# Altium schematic sheet Top.SchDoc: MICROSWIFT 2L - TOP
size 431 x 279 mm; Address1: APPLIED PHYSICS LAB; Address2: UNIVERSITY OF WASHINGTON; Address3: 1013 NE 40TH STREET; Address4: SEATTLE, WA 98105; DocumentNumber: 1; SheetNumber: 1; SheetTotal: 18; ENG_APP_DATE: --/--/--; DSN_APP_DATE: --/--/--; CHK_APP_DATE: --/--/--
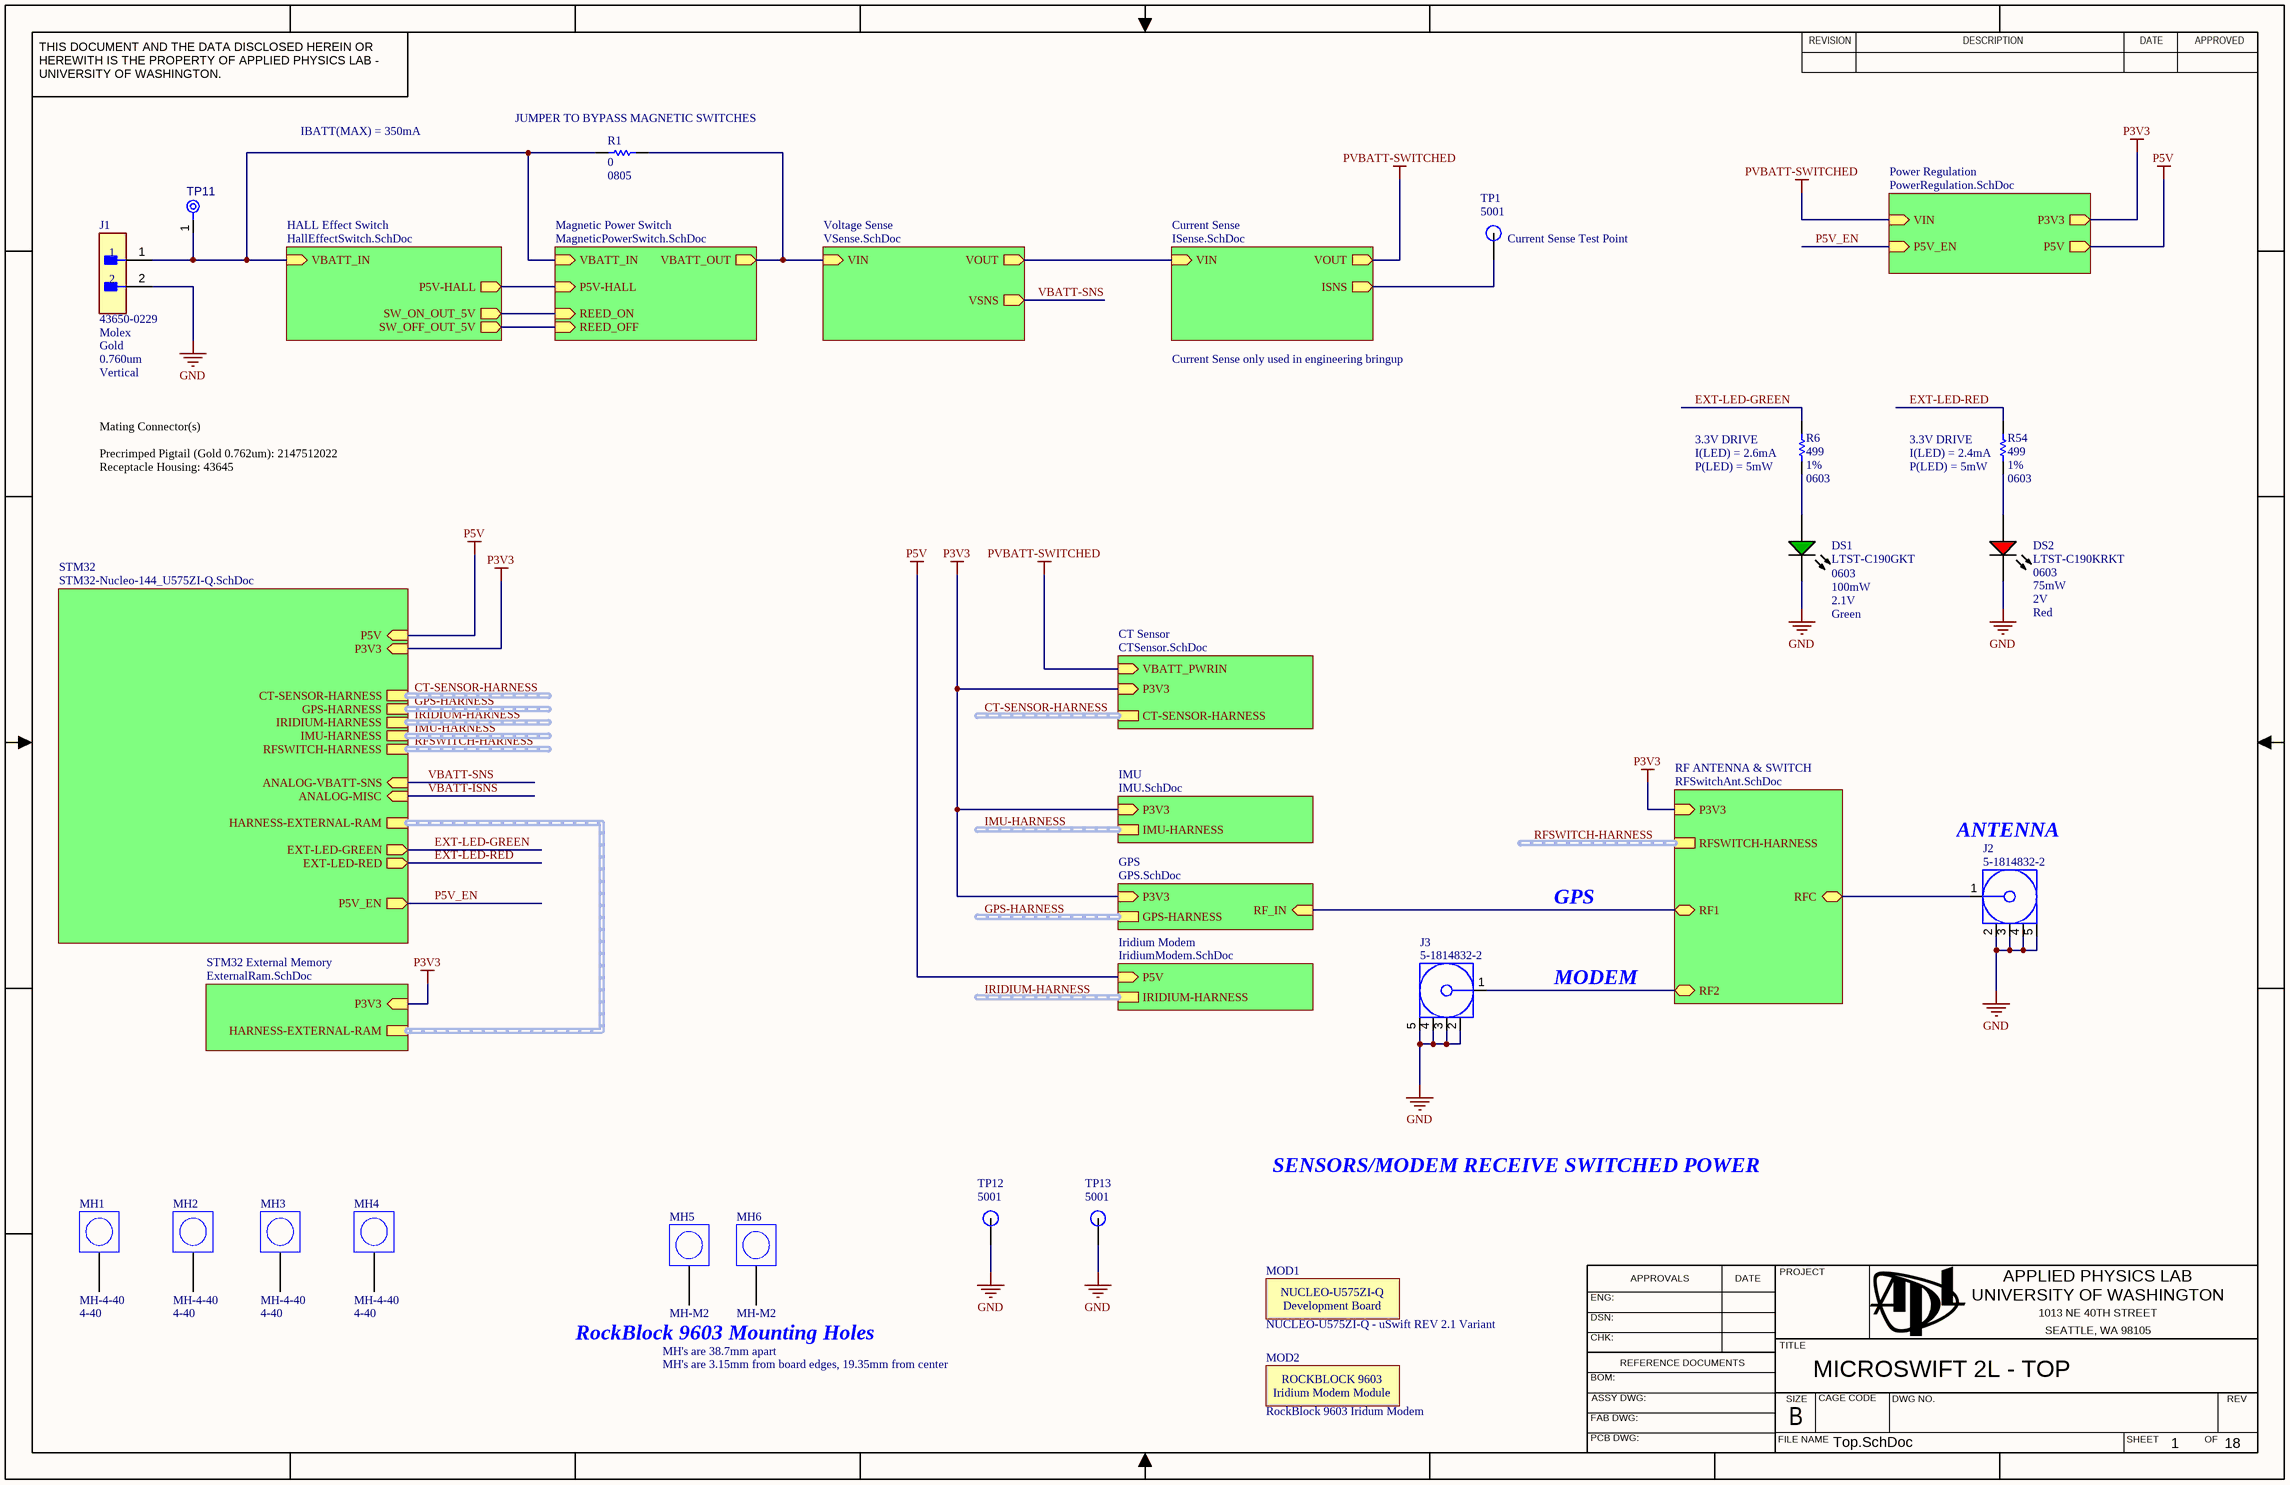
[diagram p0: Top.SchDoc]

## Parts
DS1  LTST-C190GKT  Power: 100mW  Colour: Green  Forward Voltage: 2.1V  Case/Package: 0603  [LTST-C190GKT_V]
DS2  LTST-C190KRKT  Case/Package: 0603  Power: 75mW  Forward Voltage: 2V  Illumination Colour: Red  [LTST-C191KRKT_V]
J1  43650-0229  Manufacturer: Molex  Contact Plating: Gold  Plating Thickness: 0.760um  Orientation: Vertical  [FP-43650-0229-MFG]
J2  5-1814832-2  [FP-5-1814832-2-MFG]
J3  5-1814832-2  [FP-5-1814832-2-MFG]
MH1  MH-4-40  Fastener Size: 4-40  [MH-4-40-Footprint]  (no BOM)
MH2  MH-4-40  Fastener Size: 4-40  [MH-4-40-Footprint]  (no BOM)
MH3  MH-4-40  Fastener Size: 4-40  [MH-4-40-Footprint]  (no BOM)
MH4  MH-4-40  Fastener Size: 4-40  [MH-4-40-Footprint]  (no BOM)
MH5  MH-M2  [MH-M2-Footprint]  (no BOM)
MH6  MH-M2  [MH-M2-Footprint]  (no BOM)
MOD1  NUCLEO-U575ZI-Q - uSwift REV 2.1 Variant  [NUCLEO-U575ZI-Q - uSwift REV 2.1 Variant]
MOD2  RockBlock 9603 Iridum Modem  [RockBlock 9603]
R1  value 0  Case/Package: 0805  [RESC2013X60X35ML10T20]  (hidden comment: Resistor 0R +/- 5% 0805 125 mW)
R6  value 499  Tolerance: 1%  Case/Package: 0603  [RESC1609X50X30ML08T20]  (hidden comment: Resistor 499R +/-1% 0603 100 mW)
R54  value 499  Tolerance: 1%  Case/Package: 0603  [RESC1609X50X30ML08T20]  (hidden comment: Resistor 499R +/-1% 0603 100 mW)
TP1  5001  [FP-5001-MFG]
TP11  TPAD6R-CIRCLED  [TP06R - Circled]  (value not drawn)  (no BOM)
TP12  5001  [FP-5001-MFG]
TP13  5001  [FP-5001-MFG]

## Sub-sheets
CT Sensor = CTSensor.SchDoc: VBATT_PWRIN (in), P3V3 (in), CT-SENSOR-HARNESS (harness CT-SENSOR)
Current Sense = ISense.SchDoc: VIN (in), VOUT (out), ISNS (out)
GPS = GPS.SchDoc: RF_IN (in), P3V3 (in), GPS-HARNESS (harness GPS)
HALL Effect Switch = HallEffectSwitch.SchDoc: VBATT_IN (in), SW_ON_OUT_5V (out), SW_OFF_OUT_5V (out), P5V-HALL (out)
IMU = IMU.SchDoc: P3V3 (in), IMU-HARNESS (harness IMU)
Iridium Modem = IridiumModem.SchDoc: P5V (in), IRIDIUM-HARNESS (harness IRIDIUM)
Magnetic Power Switch = MagneticPowerSwitch.SchDoc: VBATT_OUT (out), REED_ON (in), REED_OFF (in), VBATT_IN (in), P5V-HALL (in)
Power Regulation = PowerRegulation.SchDoc: VIN (in), P3V3 (out), P5V (out), P5V_EN (in)
RF ANTENNA & SWITCH = RFSwitchAnt.SchDoc: RF1 (bidir), RF2 (bidir), RFC (bidir), P3V3 (in), RFSWITCH-HARNESS (harness RFSWITCH)
STM32 = STM32-Nucleo-144_U575ZI-Q.SchDoc: P5V (in), P3V3 (in), CT-SENSOR-HARNESS (harness CT-SENSOR), GPS-HARNESS (harness GPS), IRIDIUM-HARNESS (harness IRIDIUM), IMU-HARNESS (harness IMU), RFSWITCH-HARNESS (harness RFSWITCH), ANALOG-VBATT-SNS (in), ANALOG-MISC (in), HARNESS-EXTERNAL-RAM (harness EXTERNAL-RAM), EXT-LED-GREEN (out), EXT-LED-RED (out), P5V_EN (out)
STM32 External Memory = ExternalRam.SchDoc: HARNESS-EXTERNAL-RAM (harness EXTERNAL-RAM), P3V3 (in)
Voltage Sense = VSense.SchDoc: VIN (in), VOUT (out), VSNS (out)

## Nets
GND: DS1.2(K) DS2.2(K) J1.2 J2.2 J2.3 J2.4 J2.5 J3.2 J3.3 J3.4 J3.5 TP12.1 TP13.1
P3V3: sheet STM32/P3V3, sheet Power Regulation/P3V3, sheet CT Sensor/P3V3, sheet IMU/P3V3, sheet RF ANTENNA & SWITCH/P3V3, sheet GPS/P3V3, sheet STM32 External Memory/P3V3
P5V: sheet STM32/P5V, sheet Power Regulation/P5V, sheet Iridium Modem/P5V
PVBATT-SWITCHED: sheet Power Regulation/VIN, sheet Current Sense/VOUT, sheet CT Sensor/VBATT_PWRIN
EXT-LED-GREEN: R6.1 ; sheet STM32/EXT-LED-GREEN
EXT-LED-RED: R54.1 ; sheet STM32/EXT-LED-RED
P5V_EN: sheet STM32/P5V_EN, sheet Power Regulation/P5V_EN
VBATT-ISNS: sheet STM32/ANALOG-MISC
VBATT-SNS: sheet STM32/ANALOG-VBATT-SNS, sheet Voltage Sense/VSNS
NetDS1_1: DS1.1(A) R6.2
NetDS2_1: DS2.1(A) R54.2
NetJ1_1: J1.1 R1.1 TP11.1(TP) ; sheet HALL Effect Switch/VBATT_IN, sheet Magnetic Power Switch/VBATT_IN
NetJ2_1: J2.1 ; sheet RF ANTENNA & SWITCH/RFC
NetJ3_1: J3.1 ; sheet RF ANTENNA & SWITCH/RF2
NetR1_2: R1.2 ; sheet Voltage Sense/VIN, sheet Magnetic Power Switch/VBATT_OUT
NetTP1_1: TP1.1 ; sheet Current Sense/ISNS
(unnamed): sheet Voltage Sense/VOUT, sheet Current Sense/VIN
(unnamed): sheet RF ANTENNA & SWITCH/RF1, sheet GPS/RF_IN
(unnamed): sheet HALL Effect Switch/SW_ON_OUT_5V, sheet Magnetic Power Switch/REED_ON
(unnamed): sheet HALL Effect Switch/SW_OFF_OUT_5V, sheet Magnetic Power Switch/REED_OFF
(unnamed): sheet HALL Effect Switch/P5V-HALL, sheet Magnetic Power Switch/P5V-HALL

Not connected (* = marked no-connect by the designer): MH1 1; MH2 1; MH3 1; MH4 1; MH5 1; MH6 1

## Buses and harness runs
harness CT-SENSOR-HARNESS = sheet CT Sensor/CT-SENSOR-HARNESS
harness CT-SENSOR-HARNESS = sheet STM32/CT-SENSOR-HARNESS
harness GPS-HARNESS = sheet GPS/GPS-HARNESS
harness GPS-HARNESS = sheet STM32/GPS-HARNESS
harness IMU-HARNESS = sheet IMU/IMU-HARNESS
harness IMU-HARNESS = sheet STM32/IMU-HARNESS
harness IRIDIUM-HARNESS = sheet Iridium Modem/IRIDIUM-HARNESS
harness IRIDIUM-HARNESS = sheet STM32/IRIDIUM-HARNESS
harness RFSWITCH-HARNESS = sheet RF ANTENNA & SWITCH/RFSWITCH-HARNESS
harness RFSWITCH-HARNESS = sheet STM32/RFSWITCH-HARNESS
harness sheet STM32 External Memory/HARNESS-EXTERNAL-RAM = sheet STM32/HARNESS-EXTERNAL-RAM

## Notes on the sheet
- IBATT(MAX) = 350mA
- (near R1) JUMPER TO BYPASS MAGNETIC SWITCHES
- (near TP1) Current Sense Test Point
- Current Sense only used in engineering bringup
- Mating Connector(s)
  Precrimped Pigtail (Gold 0.762um): 2147512022
  Receptacle Housing: 43645
- (near R6) 3.3V DRIVE
- (near R6) I(LED) = 2.6mA
- (near R6) P(LED) = 5mW
- (near R54) 3.3V DRIVE
- (near R54) I(LED) = 2.4mA
- (near R54) P(LED) = 5mW
- ANTENNA
- GPS
- MODEM
- SENSORS/MODEM RECEIVE SWITCHED POWER
- RockBlock 9603 Mounting Holes
- MH's are 38.7mm apart
- MH's are 3.15mm from board edges, 19.35mm from center
- THIS DOCUMENT AND THE DATA DISCLOSED HEREIN OR HEREWITH IS THE PROPERTY OF APPLIED PHYSICS LAB - UNIVERSITY OF WASHINGTON.
- REVISION
- DESCRIPTION
- DATE
- APPROVED
- ENG:
- APPROVALS
- PROJECT
- DSN:
- CHK:
- REFERENCE DOCUMENTS
- TITLE
- BOM:
- FAB DWG:
- PCB DWG:
- ASSY DWG:
- FILE NAME
- SIZE
- B
- CAGE CODE
- DWG NO.
- SHEET
- OF
- REV
- (in symbol CMP-001-0007-2) NUCLEO-U575ZI-Q; Development Board
- (in symbol CMP-001-0008-2) ROCKBLOCK 9603; Iridium Modem Module

## Library data of the parts
DS1 = CMP-007-00022-3: LED Uni-Color Green, 100 mW, 30 mA, -55 to 85 degC, 2-Pin SMD, RoHS, Tape and Reel; Manufacturer: Lite-On; Viewing Angle: 130degrees; Forward Current: 20mA; Luminous Intensity: 6mcd; Lens Style: Clear; Manufacturer URL: http://www.us.liteon.com/; RoHS Compliant: True; Package Description: 2-Pin Surface Mount Device, Body 1.6 x 0.8 mm; Datasheet URL: http://datasheet.octopart.com/LTST-C190GKT-Lite-On-datasheet-158530.pdf; Datasheet Version: Dec-06; Package Reference: C190GKT; Packaging: TapeandReel; Min Operating Temperature: -55°C; Nominal Vf: 2.1V; Package Quantity: 3000; Illumination Colour: Green; Max Operating Temperature: 85°C; Pins: 2; Mount: Surface Mount
DS2 = CMP-007-00024-3: LED Uni-Color Red, 62.5 mW, 25 mA, -30 to 85 degC, 2-Pin SMD, RoHS, Tape and Reel; Manufacturer: Lite-On; Luminous Intensity: 54mcd; Lens Style: Diffused; Viewing Angle: 130degrees; Forward Current: 20mA; Manufacturer URL: http://www.us.liteon.com/; Datasheet Version: Rev. F, 05/2013; Package Reference: C191KRKT; Datasheet URL: http://optoelectronics.liteon.com/upload/download/DS-22-99-0151/S_110_LTST-C190KRKT.pdf; Package Description: 2-Pin Surface Mount Device, Body 1.6 x 0.8 mm; Nominal Vf: 2V; Packaging: TapeandReel; RoHS Compliant: True; Pins: 2; Colour: Red; Package Quantity: 3000; Min Operating Temperature: -55°C; Max Operating Temperature: 85°C; Mount: Surface Mount
J1 = CMP-002-00120-6: Conn Wire to Board HDR 2 POS 3mm Solder ST Top Entry Thru-Hole Micro-Fit 3.0 Tray; Pitch: 3.00mm; Number of Positions: 2; __ORIG_LIFECYCLESTATEGUID__: 706004B5-C76E-482E-903B-BA0E4FAE086A; Max Current Rating: 7A; Connector Type: Male Pin; Gender: Male; Temperature - Low: -40; Temperature - High: +125; Rows: 1; Max Voltage Rating (DC): 600V; Housing Material: Thermoplastic; Number of Rows: 1; Series: Micro-Fit 3.0 43650; Termination: Through Hole; Case/Package: Header; Mount: Through Hole; Min Operating Temperature: -40C; Circuits: 2; Pin Count: 2; Contact Type: Male Pin; Number of Circuits: 2; Color: Black; Max Operating Temperature: 125C; Number of Contacts: 2; Design Item ID: 43650-0229
J2 J3 = CMP-002-00119-5: SMA Connector Jack, Female Socket 50Ohm Through Hole Solder; Manufacturer: TE Connectivity; Connector Type: RF&Coax; Gender: Female; Case/Package: SMA; Mount: Through Hole
MH1-MH4 = CMP-00028-00017-3: 4-40 plated mounting hole with button head pad.; Plated: Yes; Mechanical Type: Mounting Hole
MH5 MH6 = CMP-00028-00012-4: M2 plated mounting hole.; Plated: Yes; Fastener Size: M2; Mechanical Type: Mounting Hole
MOD1 = CMP-001-0007-2
MOD2 = CMP-001-0008-2: RockBlock 9603 Iridium Modem
R1 = CMP-009-00007-7: Chip Resistor, 0 Ohm, 0.125 W, -55 to 155 degC, 0805 (2012 Metric); Power: 125mW; Voltage Rating: 50V; Min Operating Temperature: -55°C; Max Operating Temperature: 155°C; Pins: 2; RoHS Compliant: True; Tolerance: 5%; Mount: Surface Mount; Decade: 0
R6 R54 = CMP-009-00760-5: Chip Resistor, 499 Ohm, +/- 1%, 0.1 W, -55 to 155 degC, 0603 (1608 Metric); Power: 100mW; Decade: 100; Voltage Rating: 75V; RoHS Compliant: Yes; Pins: 2; Max Operating Temperature: 155°C; Min Operating Temperature: -55°C; Mount: Surface Mount
TP1 TP12 TP13 = CMP-001-0002-6: TEST POINT PC MINI .040D BLACK; Mount: Through Hole; Color: Black; Height: 0.3inch; Material: Nylon,Bronze,Silver; Series: THM; Contact Material: Bronze; Contact Plating: Silver,Tin
TP11 = CMP-00028-00014-3: 0.6mm round with a silkscreen circle.; Pins: 1